# Altium schematic sheet 28Pins_Schematic.SchDoc (part 1 of 4)
size A2
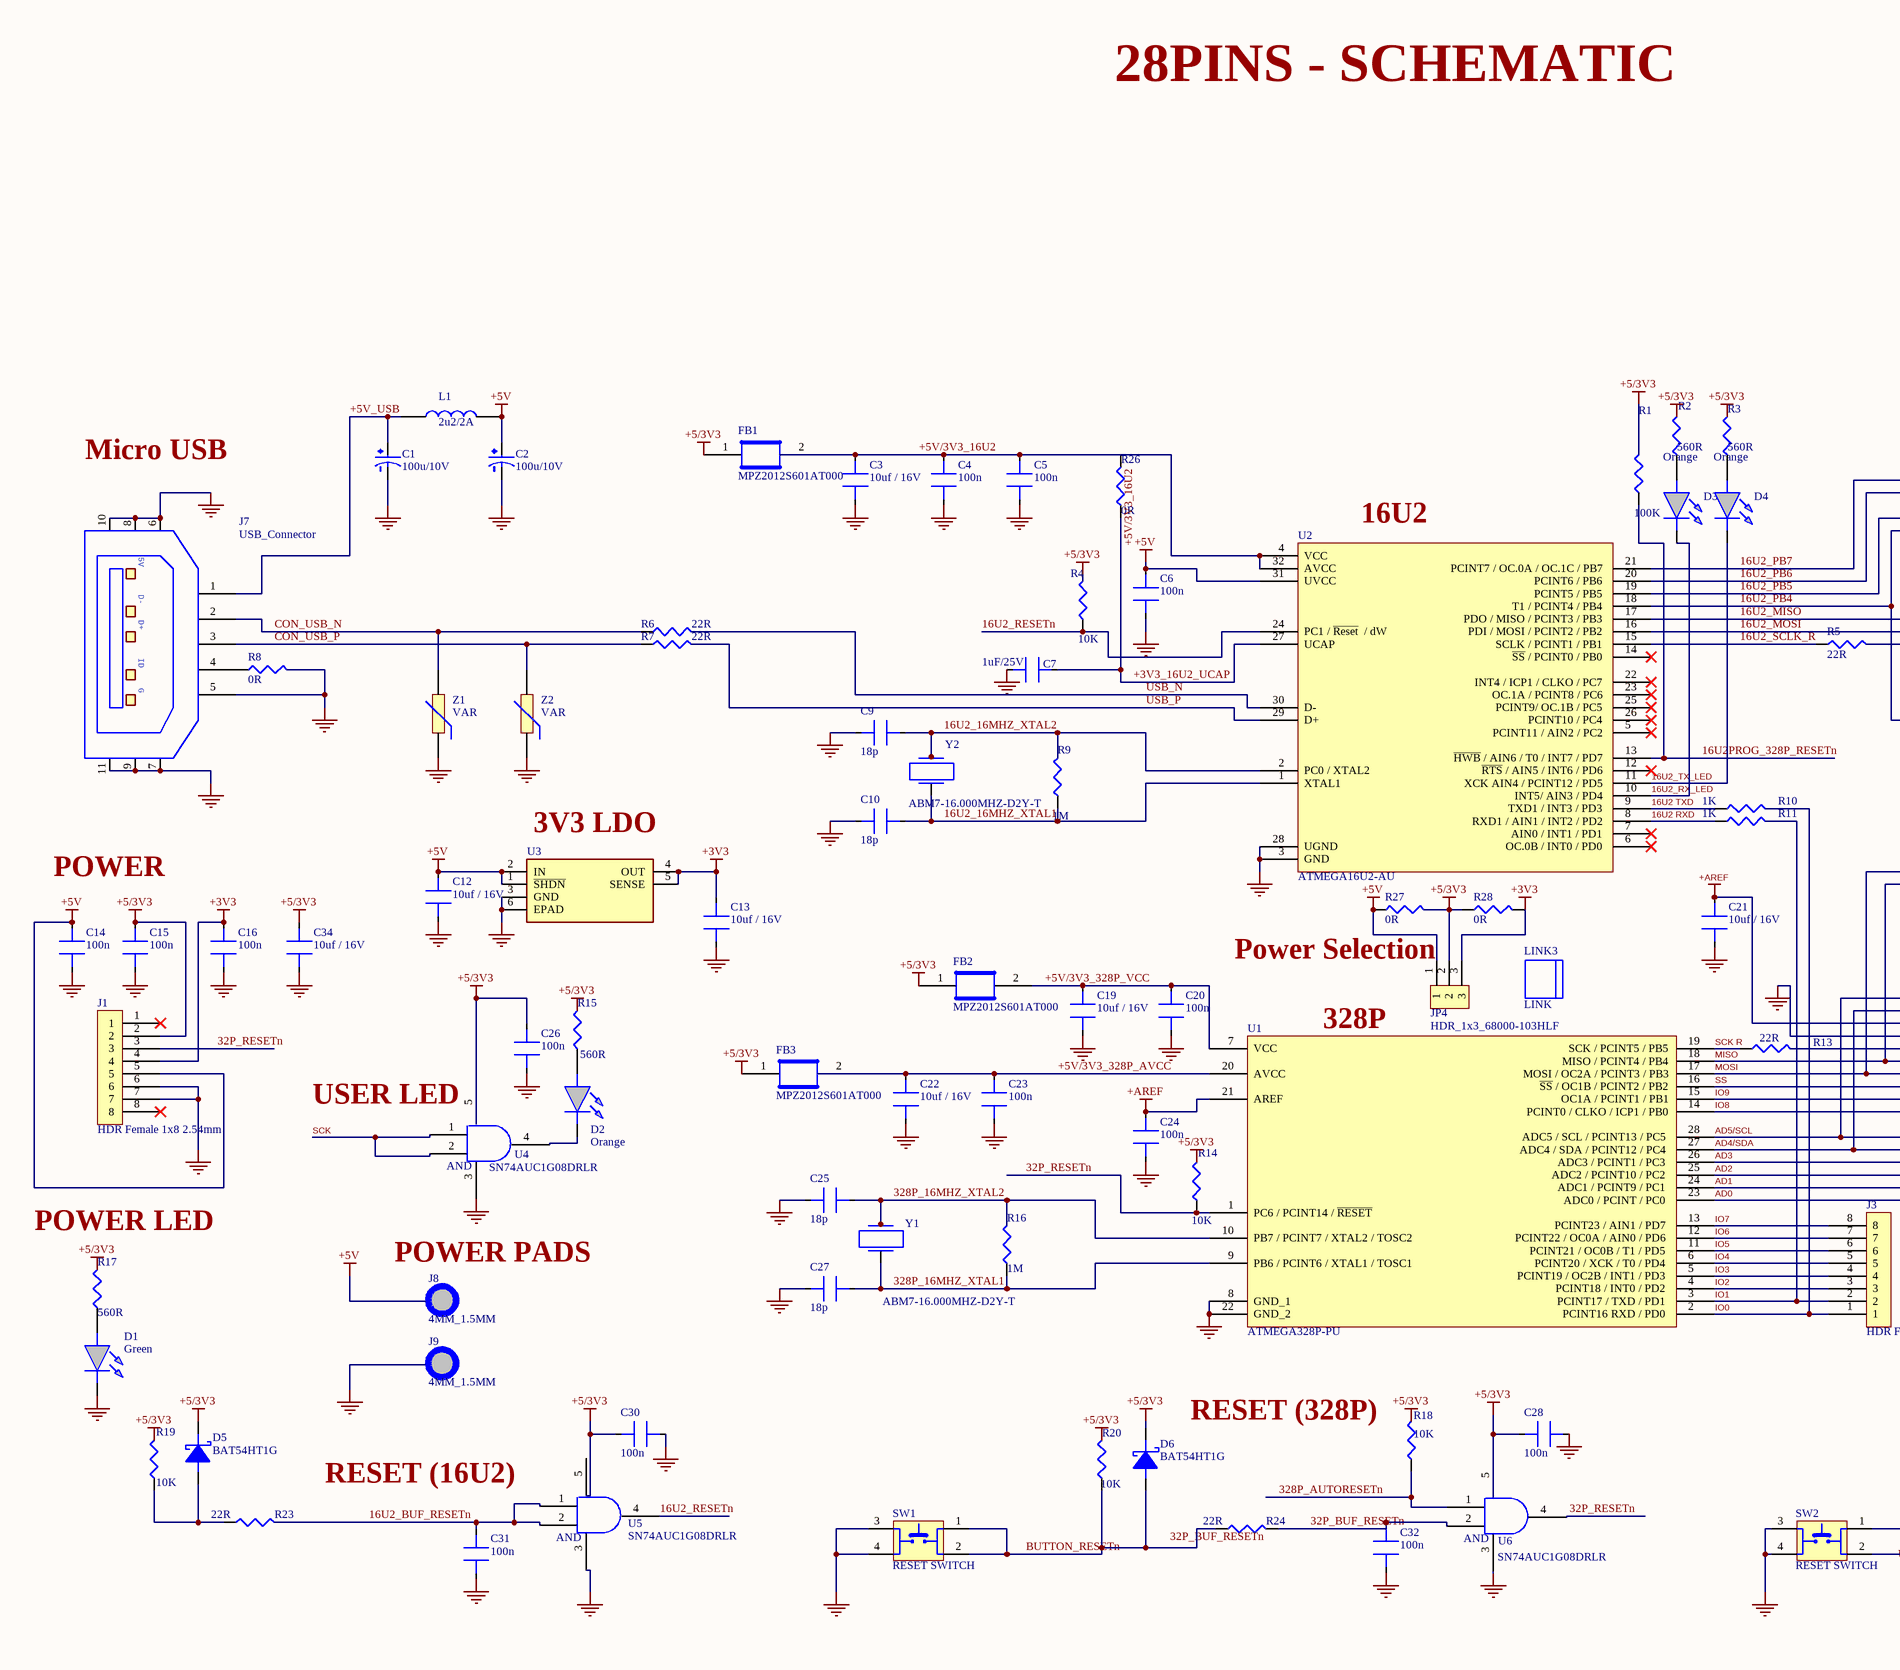
[diagram p0: 28Pins_Schematic.SchDoc, left]
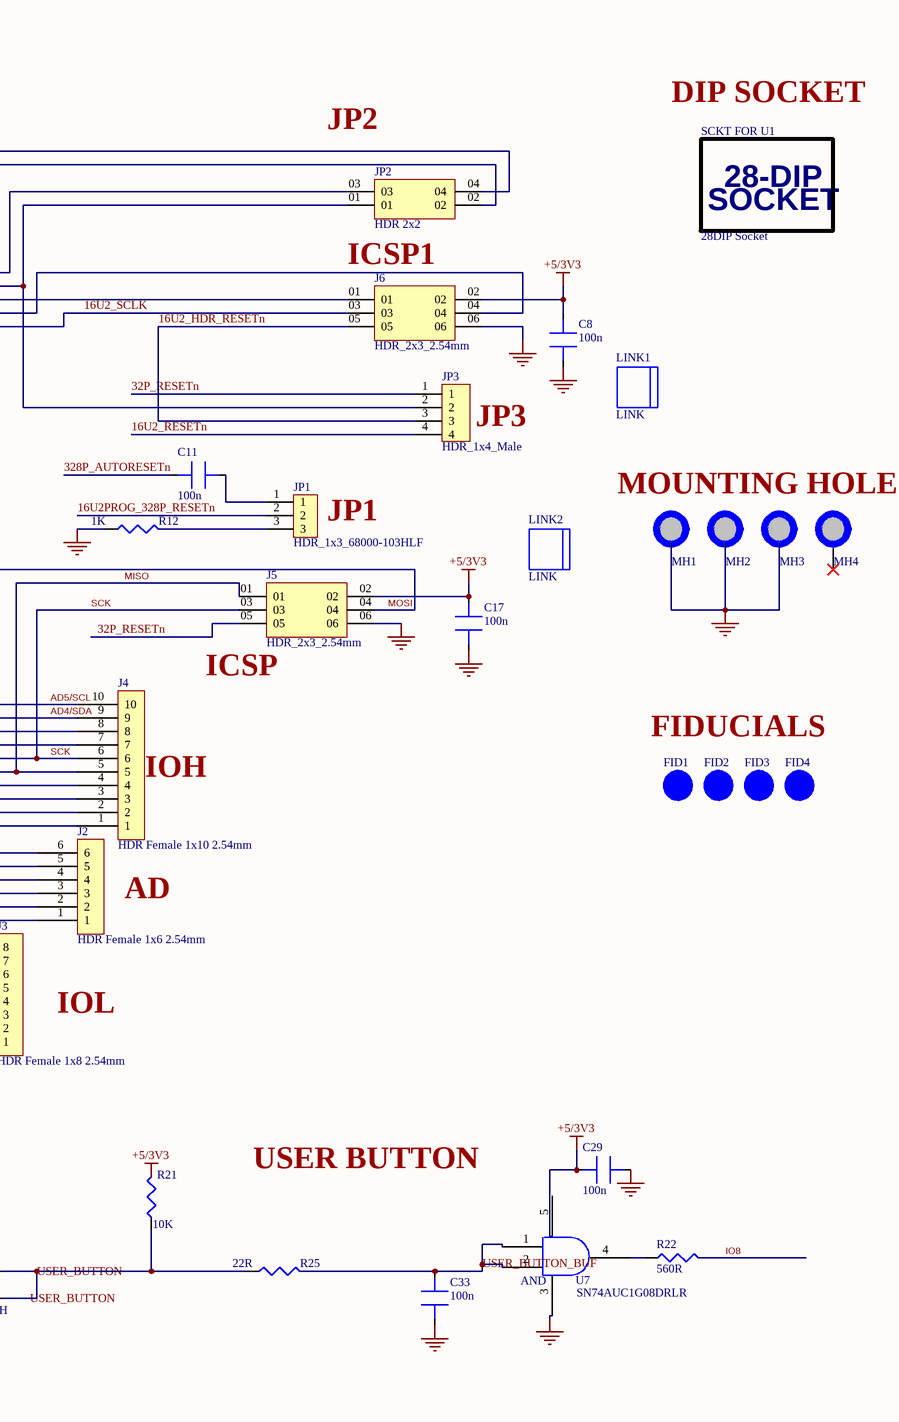
[diagram p1: 28Pins_Schematic.SchDoc, right]

## Parts
C1  100u/10V  [CAP_EEE1AA101WR]
C2  100u/10V  [CAP_EEE1AA101WR]
C3  10uf / 16V  [C0805]
C4  100n  [C0805]
C5  100n  [C0805]
C6  100n  [C0805]
C7  1uF/25V  [C0805]
C8  100n  [C0805]
C9  18p  [C0805]
C10  18p  [C0805]
C11  100n  [C0805]
C12  10uf / 16V  [C0805]
C13  10uf / 16V  [C0805]
C14  100n  [C0805]
C15  100n  [C0805]
C16  100n  [C0805]
C17  100n  [C0805]
C19  10uf / 16V  [C0805]
C20  100n  [C0805]
C21  10uf / 16V  [C0805]
C22  10uf / 16V  [C0805]
C23  100n  [C0805]
C24  100n  [C0805]
C25  18p  [C0805]
C26  100n  [C0805]
C27  18p  [C0805]
C28  100n  [C0805]
C29  100n  [C0805]
C30  100n  [C0805]
C31  100n  [C0805]
C32  100n  [C0805]
C33  100n  [C0805]
C34  10uf / 16V  [C0805]
D1  Green  [LED_SODFL1708X67N]
D2  Orange  [LED_SODFL1708X67N]
D3  Orange  [LED_SODFL1708X67N]
D4  Orange  [LED_SODFL1708X67N]
D5  BAT54HT1G  [SOD323]
D6  BAT54HT1G  [SOD323]
FB1  MPZ2012S601AT000  [C0805]
FB2  MPZ2012S601AT000  [C0805]
FB3  MPZ2012S601AT000  [C0805]
FID1  FID_1MM  [FID_40x120]  (value not drawn)  (no BOM)
FID2  FID_1MM  [FID_40x120]  (value not drawn)  (no BOM)
FID3  FID_1MM  [FID_40x120]  (value not drawn)  (no BOM)
FID4  FID_1MM  [FID_40x120]  (value not drawn)  (no BOM)
J1  HDR Female 1x8 2.54mm  [HDR_Female_1x8_2.54mm]
J2  HDR Female 1x6 2.54mm  [HDR_Female_1x6_2.54mm]
J3  HDR Female 1x8 2.54mm  [HDR_Female_1x8_2.54mm]
J4  HDR Female 1x10 2.54mm  [HDR_Female_1x10_2.54mm - duplicate]
J5  HDR_2x3_2.54mm  [HDR_2x3_2.54mm]
J6  HDR_2x3_2.54mm  [HDR_2x3_2.54mm]
J7  USB_Connector  [2246077-1]
J8  4MM_1.5MM  [PAD_WITH_HOLE_4MMx1.5MM]  (no BOM)
J9  4MM_1.5MM  [PAD_WITH_HOLE_4MMx1.5MM]  (no BOM)
JP1  HDR_1x3_68000-103HLF  [1x3_Male_68000-103HLF]
JP2  HDR 2x2  [HDR_2x2]
JP3  HDR_1x4_Male  [HDR_1x4_Male__68001-204HLF]
JP4  HDR_1x3_68000-103HLF  [1x3_Male_68000-103HLF]
L1  2u2/2A  [INDC3225X270N]
LINK1  LINK  (mechanical)
LINK2  LINK  (mechanical)
LINK3  LINK  (mechanical)
MH1  mh_7.4X3.2  [MH7.4X3.2]  (value not drawn)  (no BOM)
MH2  mh_7.4X3.2  [MH7.4X3.2]  (value not drawn)  (no BOM)
MH3  mh_7.4X3.2  [MH7.4X3.2]  (value not drawn)  (no BOM)
MH4  mountinghole_NONPLATED3.2  [mh7.4_nonplated]  (value not drawn)  (no BOM)
R1  100K  [R0805]
R2  560R  [R0805]
R3  560R  [R0805]
R4  10K  [R0805]
R5  22R  [R0805]
R6  22R  [R0805]
R7  22R  [R0805]
R8  0R  [R0805]
R9  1M  [R0805]
R10  1K  [R0805]
R11  1K  [R0805]
R12  1K  [R0805]
R13  22R  [R0805]
R14  10K  [R0805]
R15  560R  [R0805]
R16  1M  [R0805]
R17  560R  [R0805]
R18  10K  [R0805]
R19  10K  [R0805]
R20  10K  [R0805]
R21  10K  [R0805]
R22  560R  [R0805]
R23  22R  [R0805]
R24  22R  [R0805]
R25  22R  [R0805]
R26  0R  [R0805]
R27  0R  [R0805]
R28  0R  [R0805]
SCKT_FOR_U1  28DIP Socket  [28dip_7.62MM_SOCKET]
SW1  RESET SWITCH  [SW_1825910-6-4]
SW2  RESET SWITCH  [SW_1825910-6-4]
U1  ATMEGA328P-PU  [28_DIP_7.62mm]
U2  ATMEGA16U2-AU  [TQFP32]
U3  TL1963A-33DCQR  [SOT127P706X180-6N]  (value not drawn)
U4  SN74AUC1G08DRLR  [DBV_SOTP]
U5  SN74AUC1G08DRLR  [DBV_SOTP]
U6  SN74AUC1G08DRLR  [DBV_SOTP]
U7  SN74AUC1G08DRLR  [DBV_SOTP]
Y1  ABM7-16.000MHZ-D2Y-T  [ABM7_v1_BIG]
Y2  ABM7-16.000MHZ-D2Y-T  [ABM7_v1_BIG]
Z1  VAR  [VARC1608X55N]
Z2  VAR  [VARC1608X55N]

## Nets
+3V3: C13.2 C16.2 J1.4 JP4.3 U3.4(OUT) U3.5(SENSE)
+5/3V3: C8.2 C15.2 C17.2 C26.2 C28.2 C29.2 C30.2 C34.2 D5.1(Cathode) D6.1(Cathode) FB1.1 FB2.1 FB3.1 J1.2 J5.02 J6.02 JP4.2 R1.2 R2.2 R3.2 R4.2 R14.2 R15.2 R17.2 R18.2 R19.2 R20.2 R21.2 R27.2 R28.1 U4.5 U5.5 U6.5 U7.5
+5V: C2.1 C6.2 C12.2 C14.2 J1.5 J8.1 JP4.1 L1.2 R27.1 U2.31(UVCC) U3.1(~{SHDN}) U3.2(IN)
+AREF: C21.2 C24.2 J4.8 U1.21(AREF)
GND: C1.2 C2.2 C3.1 C4.1 C5.1 C6.1 C7.1 C9.1 C10.1 C12.1 C13.1 C14.1 C15.1 C16.1 C19.1 C20.1 C22.1 C23.1 C24.1 C25.1 C26.1 C27.1 C28.1 C29.1 C30.1 C31.1 C32.1 C33.1 C34.1 D1.1(K) J1.6 J1.7 J7.5 J7.6 J7.7 J7.8 J7.9 J7.10 J7.11 J9.1 R8.2 SW1.3 SW1.4 SW2.3 SW2.4 U1.8(GND_1) U1.22(GND_2) U2.3(GND) U2.28(UGND) U3.3(GND) U3.6(EPAD) U4.3 U5.3 U6.3 U7.3 Z1.1 Z2.1
NetC8_1: C8.1 C17.1 C21.1 J4.7 J5.06 J6.06 MH1.1 MH2.1 MH3.1 R12.1
16U2 RXD: R11.1 U2.8(RXD1_/_AIN1_/_INT2_/_PD2)
16U2 TXD: R10.1 U2.9(TXD1_/_INT3_/_PD3)
16U2_16MHZ_XTAL1: C10.2 R9.1 U2.1(XTAL1) Y2.1
16U2_16MHZ_XTAL2: C9.2 R9.2 U2.2(PC0_/_XTAL2) Y2.2
16U2_BUF_RESETn: C31.2 R23.2 U5.1 U5.2
16U2_HDR_RESETn: J6.05 JP3.3
16U2_MISO: J6.01 U2.17(PDO_/_MISO_/_PCINT3_/_PB3)
16U2_MOSI: J6.04 U2.16(PDI_/_MOSI_/_PCINT2_/_PB2)
16U2_PB4: JP2.01 JP3.2 U2.18(T1_/_PCINT4_/_PB4)
16U2_PB5: JP2.03 U2.19(PCINT5_/_PB5)
16U2_PB6: JP2.02 U2.20(PCINT6_/_PB6)
16U2_PB7: JP2.04 U2.21(PCINT7_/_OC.0A_/_OC.1C_/_PB7)
16U2_RESETn: JP3.4 R4.1 U2.24(PC1_/_~{Reset}__/_dW) U5.4
16U2_RX_LED: D3.1(K) U2.10(INT5/_AIN3_/_PD4)
16U2_SCLK: J6.03 R5.2
16U2_SCLK_R: R5.1 U2.15(SCLK_/_PCINT1_/_PB1)
16U2_TX_LED: D4.1(K) U2.11(XCK_AIN4_/_PCINT12_/_PD5)
16U2PROG_328P_RESETn: JP1.2 R1.1 U2.13(~{HWB}_/_AIN6_/_T0_/_INT7_/_PD7)
32P_BUF_RESETn: C32.2 R24.2 U6.2
32P_RESETn: J1.3 J5.05 JP3.1 R14.1 U1.1(PC6_/_PCINT14_/_~{RESET}) U6.4
328P_16MHZ_XTAL1: C27.2 R16.1 U1.9(PB6_/_PCINT6_/_XTAL1_/_TOSC1) Y1.1
328P_16MHZ_XTAL2: C25.2 R16.2 U1.10(PB7_/_PCINT7_/_XTAL2_/_TOSC2) Y1.2
328P_AUTORESETn: C11.1 R18.1 U6.1
+3V3_16U2_UCAP: C7.2 R26.1 U2.27(UCAP)
+5V/3V3_16U2: C3.2 C4.2 C5.2 FB1.2 R26.2 U2.4(VCC) U2.32(AVCC)
+5V/3V3_328P_AVCC: C22.2 C23.2 FB3.2 U1.20(AVCC)
+5V/3V3_328P_VCC: C19.2 C20.2 U1.7(VCC)
+5V_USB: C1.1 J7.1 L1.1
AD0: J2.1 U1.23(ADC0_/_PCINT_/_PC0)
AD1: J2.2 U1.24(ADC1_/_PCINT9_/_PC1)
AD2: J2.3 U1.25(ADC2_/_PCINT10_/_PC2)
AD3: J2.4 U1.26(ADC3_/_PCINT1_/_PC3)
AD4/SDA: J2.5 J4.9 U1.27(ADC4_/_SDA_/_PCINT12_/_PC4)
AD5/SCL: J2.6 J4.10 U1.28(ADC5_/_SCL_/_PCINT13_/_PC5)
BUTTON_RESETn: D6.2(Anode) R20.1 R24.1 SW1.1 SW1.2
CON_USB_N: J7.2 R6.1 Z1.2
CON_USB_P: J7.3 R7.1 Z2.2
IO0: J3.1 R10.2 U1.2(PCINT16_RXD_/_PD0)
IO1: J3.2 R11.2 U1.3(PCINT17_/_TXD_/_PD1)
IO2: J3.3 U1.4(PCINT18_/_INT0_/_PD2)
IO3: J3.4 U1.5(PCINT19_/_OC2B_/_INT1_/_PD3)
IO4: J3.5 U1.6(PCINT20_/_XCK_/_T0_/_PD4)
IO5: J3.6 U1.11(PCINT21_/_OC0B_/_T1_/_PD5)
IO6: J3.7 U1.12(PCINT22_/_OC0A_/_AIN0_/_PD6)
IO7: J3.8 U1.13(PCINT23_/_AIN1_/_PD7)
IO8: J4.1 R22.2 U1.14(PCINT0_/_CLKO_/_ICP1_/_PB0)
IO9: J4.2 U1.15(OC1A_/_PCINT1_/_PB1)
MISO: J4.5 J5.01 U1.18(MISO_/_PCINT4_/_PB4)
MOSI: J4.4 J5.04 U1.17(MOSI_/_OC2A_/_PCINT3_/_PB3)
SCK: J4.6 J5.03 R13.2 U4.1 U4.2
SCK R: R13.1 U1.19(SCK_/_PCINT5_/_PB5)
SS: J4.3 U1.16(~{SS}_/_OC1B_/_PCINT2_/_PB2)
USB_N: R6.2 U2.30(D-)
USB_P: R7.2 U2.29(D+)
USER_BUTTON: R21.1 R25.1 SW2.1 SW2.2
USER_BUTTON_BUF: C33.2 R25.2 U7.1 U7.2
NetC11_2: C11.2 JP1.1
NetD1_2: D1.2(A) R17.1
NetD2_1: D2.1(K) U4.4
NetD2_2: D2.2(A) R15.1
NetD3_2: D3.2(A) R2.1
NetD4_2: D4.2(A) R3.1
NetD5_2: D5.2(Anode) R19.1 R23.1
NetJ7_4: J7.4 R8.1
NetJP1_3: JP1.3 R12.2
NetR22_1: R22.1 U7.4

Not connected (* = marked no-connect by the designer): FB2 2; J1 1* 8*; MH4 1; R28 2; U2 5(PCINT11_/_AIN2_/_PC2_)* 6(OC.0B_/_INT0_/_PD0_)* 7(AIN0_/_INT1_/_PD1_)* 12(~{RTS}_/_AIN5_/_INT6_/_PD6_)* 14(~{SS}_/_PCINT0_/_PB0_)* 22(INT4_/_ICP1_/_CLKO_/_PC7_)* 23(OC.1A_/_PCINT8_/_PC6_)* 25(PCINT9/_OC.1B_/_PC5_)* 26(PCINT10_/_PC4_)*

## Notes on the sheet
- 28PINS - SCHEMATIC
- Micro USB
- JP2
- DIP SOCKET
- (near U2) 16U2
- ICSP1
- (near JP3) JP3
- (near U3) 3V3 LDO
- (near JP1) JP1
- MOUNTING HOLES
- POWER
- Power Selection
- (near U1) 328P
- (near J5) ICSP
- FIDUCIALS
- (near J4) IOH
- (near U4) USER LED
- AD
- (near R17) POWER LED
- (near J8) POWER PADS
- IOL
- RESET (328P)
- USER BUTTON
- RESET (16U2)
- (in symbol 4828-3004-CP) 28-DIP; SOCKET
- (in symbol 10118193-0001LF) 5V; D-; D+; ID; G